# EAGLE design switch.m16 (EAGLE 6.5.0)
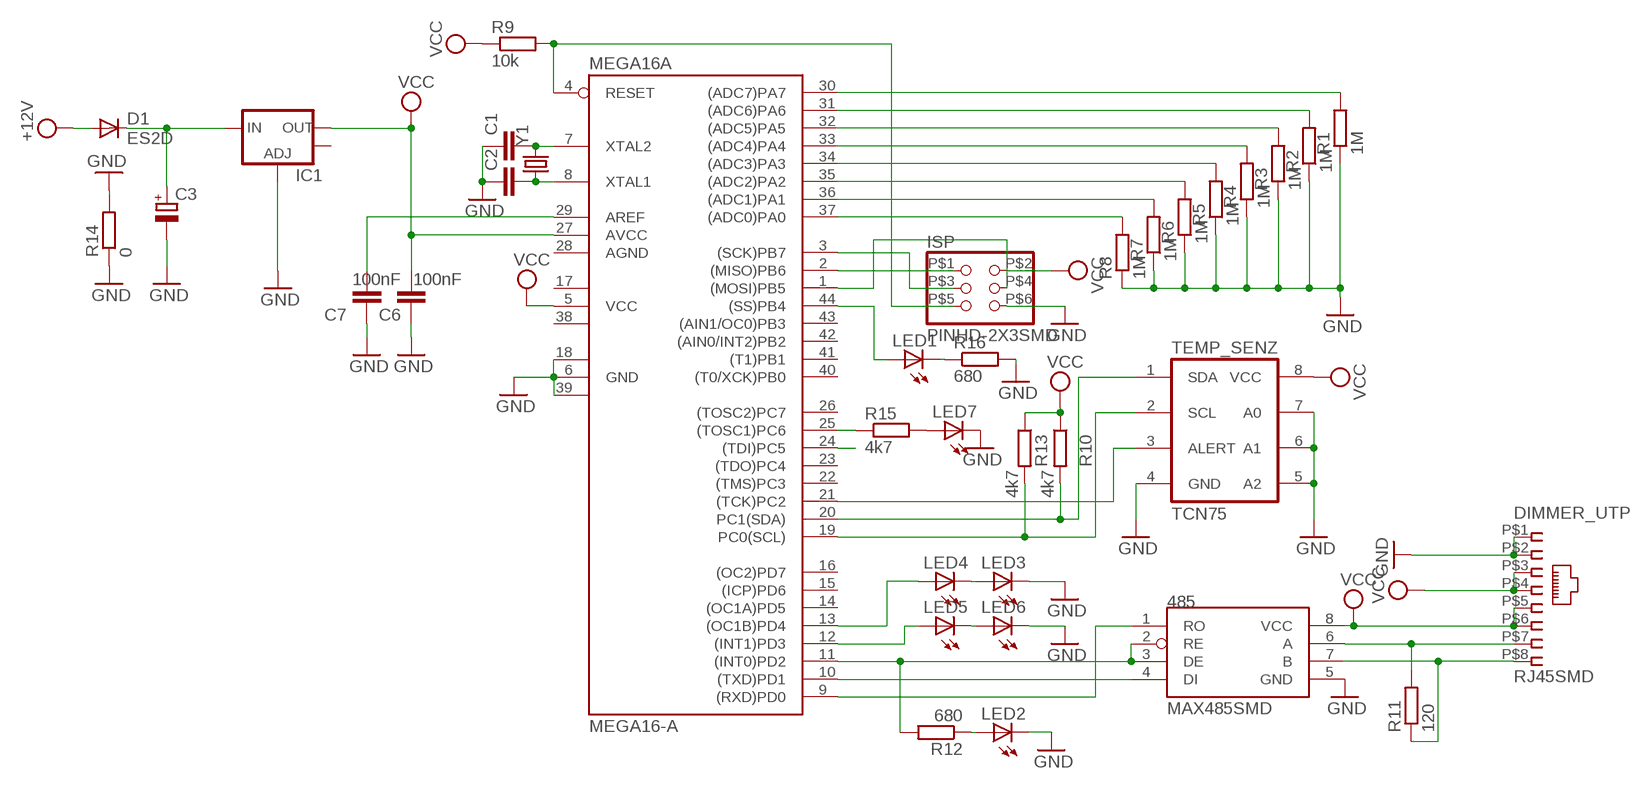
[diagram p0: schematic, sheet 1]

## Parts
485  MAX485SMD  [SO08]
C1  C-EUC0805  [C0805]
C2  C-EUC0805  [C0805]
C3  CPOL-EUSMCC  [SMC_C]
C6  100nF  C-EUC1206  [C1206]
C7  100nF  C-EUC1206  [C1206]
D1  ES2D  [SMB]
DIMMER_UTP  RJ45SMD  [RJ45SMD]
IC1  V_REG_LM1117SOT223  [SOT223]
ISP  PINHD-2X3SMD  [2X03SMD]
LED1  LEDSML1206  [SML1206]
LED2  LEDSML1206  [SML1206]
LED3  LEDSML1206  [SML1206]
LED4  LEDSML1206  [SML1206]
LED5  LEDSML1206  [SML1206]
LED6  LEDSML1206  [SML1206]
LED7  LEDSML1206  [SML1206]
MEGA16A  MEGA16-A  [TQFP44]
R1  1M  R-EU_R1206  [R1206]
R2  1M  R-EU_R1206  [R1206]
R3  1M  R-EU_R1206  [R1206]
R4  1M  R-EU_R1206  [R1206]
R5  1M  R-EU_R1206  [R1206]
R6  1M  R-EU_R1206  [R1206]
R7  1M  R-EU_R1206  [R1206]
R8  1M  R-EU_R1206  [R1206]
R9  10k  R-EU_R1206  [R1206]
R10  4k7  R-EU_R1206  [R1206]
R11  120  R-EU_R1206  [R1206]
R12  680  R-EU_R1206  [R1206]
R13  4k7  R-EU_R1206  [R1206]
R14  0  R-EU_R1206  [R1206]
R15  4k7  R-EU_R1206  [R1206]
R16  680  R-EU_R1206  [R1206]
TEMP_SENZ  TCN75  [SO08]
Y1  CRYSTAL5X3  [CRYSTAL-SMD-5X3]

## Nets
+12V: D1.A DIMMER_UTP.P$3 DIMMER_UTP.P$4 ; supply symbol labelled VCC
GND: 485.5(GND) C1.1 C2.1 C3.- C6.1 C7.2 DIMMER_UTP.P$1 DIMMER_UTP.P$2 IC1.1(ADJ) ISP.P$6 LED2.C LED3.C LED6.C LED7.C MEGA16A.6(GND) MEGA16A.18(GND1) MEGA16A.39(GND2) R1.1 R2.1 R3.1 R4.1 R5.1 R6.1 R7.1 R8.1 R14.1 R14.2 R16.2 TEMP_SENZ.4(GND) TEMP_SENZ.5(A2) TEMP_SENZ.6(A1) TEMP_SENZ.7(A0)
N$1: LED4.A MEGA16A.13((OC1B)PD4)
N$2: LED1.A MEGA16A.44((SS)PB4)
N$3: C3.+ D1.C IC1.3(IN)
N$4: MEGA16A.31((ADC6)PA6) R2.2
N$5: MEGA16A.30((ADC7)PA7) R1.2
N$6: MEGA16A.37((ADC0)PA0) R8.2
N$7: MEGA16A.34((ADC3)PA3) R5.2
N$8: MEGA16A.35((ADC2)PA2) R6.2
N$9: MEGA16A.25((TOSC1)PC6) R15.1
N$10: MEGA16A.19(PC0(SCL)) R13.2 TEMP_SENZ.2(SCL)
N$11: MEGA16A.20(PC1(SDA)) R10.2 TEMP_SENZ.1(SDA)
N$12: MEGA16A.21((TCK)PC2) TEMP_SENZ.3(ALERT)
N$13: LED7.A R15.2
N$15: 485.1(RO) MEGA16A.9((RXD)PD0)
N$16: 485.4(DI) MEGA16A.10((TXD)PD1)
N$17: 485.2(RE) 485.3(DE) MEGA16A.11((INT0)PD2) R12.2
N$18: LED5.A MEGA16A.12((INT1)PD3)
N$19: ISP.P$1 MEGA16A.2((MISO)PB6)
N$20: ISP.P$3 MEGA16A.3((SCK)PB7)
N$21: ISP.P$5 MEGA16A.4(RESET) R9.2
N$22: ISP.P$4 MEGA16A.1((MOSI)PB5)
N$23: 485.6(A) DIMMER_UTP.P$7 R11.2
N$24: 485.7(B) DIMMER_UTP.P$8 R11.1
N$28: C1.2 MEGA16A.7(XTAL2) Y1.3
N$29: C2.2 MEGA16A.8(XTAL1) Y1.1
N$30: LED2.A R12.1
N$31: MEGA16A.33((ADC4)PA4) R4.2
N$33: LED1.C R16.1
N$34: MEGA16A.32((ADC5)PA5) R3.2
N$35: MEGA16A.36((ADC1)PA1) R7.2
N$36: C7.1 MEGA16A.29(AREF)
N$37: LED3.A LED4.C
N$38: LED5.C LED6.A
PC5: MEGA16A.24((TDI)PC5)
VCC: 485.8(VCC) C6.2 DIMMER_UTP.P$5 DIMMER_UTP.P$6 IC1.2(OUT) ISP.P$2 MEGA16A.5(VCC) MEGA16A.27(AVCC) R9.1 R10.1 R13.1 TEMP_SENZ.8(VCC)
Unconnected: IC1.4(OUT) MEGA16A.14((OC1A)PD5) MEGA16A.15((ICP)PD6) MEGA16A.16((OC2)PD7) MEGA16A.22((TMS)PC3) MEGA16A.23((TDO)PC4) MEGA16A.26((TOSC2)PC7) MEGA16A.40((T0/XCK)PB0) MEGA16A.41((T1)PB1) MEGA16A.42((AIN0/INT2)PB2) MEGA16A.43((AIN1/OC0)PB3)

## Power pins joined to a net without a drawn wire
AGND: MEGA16A.28(AGND)
VCC1: MEGA16A.17(VCC1)
VCC2: MEGA16A.38(VCC2)

## Library data of the parts
485 = maxim:MAX485SMD
C1 C2 C6 C7 = rcl:C-EU: CAPACITOR, European symbol
C3 = rcl:CPOL-EU: POLARIZED CAPACITOR, European symbol
D1 = diode:ES2D: DIODE super fast rectifier, 2 A
DIMMER_UTP = con-tycoelectronics:RJ45SMD
IC1 = sparkfun:V_REG_LM1117: Voltage Regulator LM1117 Standard adjustable voltage regulator but in SMD form. Spark Fun Electronics SKU : COM-00595
ISP = pinhead:PINHD-2X3SMD
LED1-LED7 = led:LED: LED OSRAM: - CHIPLED LG R971, LG N971, LY N971, LG Q971, LY Q971, LO R971, LY R971 LH N974, LH R974 LS Q976, LO Q976, LY Q976 LO Q996 - Hyper CHIPLED LW Q18S LB Q993, LB Q99A, LB R99A - SideLED LS A670, LO A670, LY A670, LG A670, LP A670 LB A673, LV A673, LT A673, LW A673 LH A674 LY A675 LS A676, LA A676, LO A676, LY A676, LW A676 LS A679, LY A679, LG A679 - Hyper Micro SIDELED® LS Y876, LA Y876, LO Y876, LY Y876 LT Y87S - SmartLED LW L88C, LW L88S LB L89C, LB L89S, LG L890 LS L89K, LO L89K, LY L89K LS L896, LA L896, LO L896, LY L896 - TOPLED LS T670, LO T670, LY T670, LG T670, LP T670 LSG T670, LSP T670, LSY T670, LOP T670, LYG T670 LG T671, LOG T671, LSG T671 LB T673, LV T673, LT T673, LW T673 LH T674 LS T676, LA T676, LO T676, LY T676, LB T676, LH T676, LSB T676, LW T676 LB T67C, LV T67C, LT T67C, LS T67K, LO T67K, LY T67K, LW E67C LS E67B, LA E67B, LO E67B, LY E67B, LB E67C, LV E67C, LT E67C LW T67C LS T679, LY T679, LG T679 LS T770, LO T770, LY T770, LG T770, LP T770 LB T773, LV T773, LT T773, LW T773 LH T774 LS E675, LA E675, LY E675, LS T675 LS T776, LA T776, LO T776, LY T776, LB T776 LHGB T686 LT T68C, LB T68C - Hyper Mini TOPLED® LB M676 - Mini TOPLED Santana® LG M470 LS M47K, LO M47K, LY M47K Source: http://www.osram.convergy.de LUXEON: - LUMILED® LXK2-PW12-R00, LXK2-PW12-S00, LXK2-PW14-U00, LXK2-PW14-V00 LXK2-PM12-R00, LXK2-PM12-S00, LXK2-PM14-U00 LXK2-PE12-Q00, LXK2-PE12-R00, LXK2-PE12-S00, LXK2-PE14-T00, LXK2-PE14-U00 LXK2-PB12-K00, LXK2-PB12-L00, LXK2-PB12-M00, LXK2-PB14-N00, LXK2-PB14-P00, LXK2-PB14-Q00 LXK2-PR12-L00, LXK2-PR12-M00, LXK2-PR14-Q00, LXK2-PR14-R00 LXK2-PD12-Q00, LXK2-PD12-R00, LXK2-PD12-S00 LXK2-PH12-R00, LXK2-PH12-S00 LXK2-PL12-P00, LXK2-PL12-Q00, LXK2-PL12-R00 Source: www.luxeon.com KINGBRIGHT: KA-3528ASYC Source: www.kingbright.com
MEGA16A = avr-5:MEGA16: MICROCONTROLLER 16 Kbytes FLASH 1 kbytes SRAM 512 bytes EEPROM USART 8-channel 10 bit ADC
R1-R16 = rcl:R-EU_: RESISTOR, European symbol
TEMP_SENZ = linear:TCN75
Y1 = sparkfun:CRYSTAL: Crystals Various standard crystals. Proven footprints. Spark Fun Electronics SKU : COM-00534

## Net classes
0 default: width 0.406 mm, drill 0.406 mm, clearance 0.406 mm

## Board
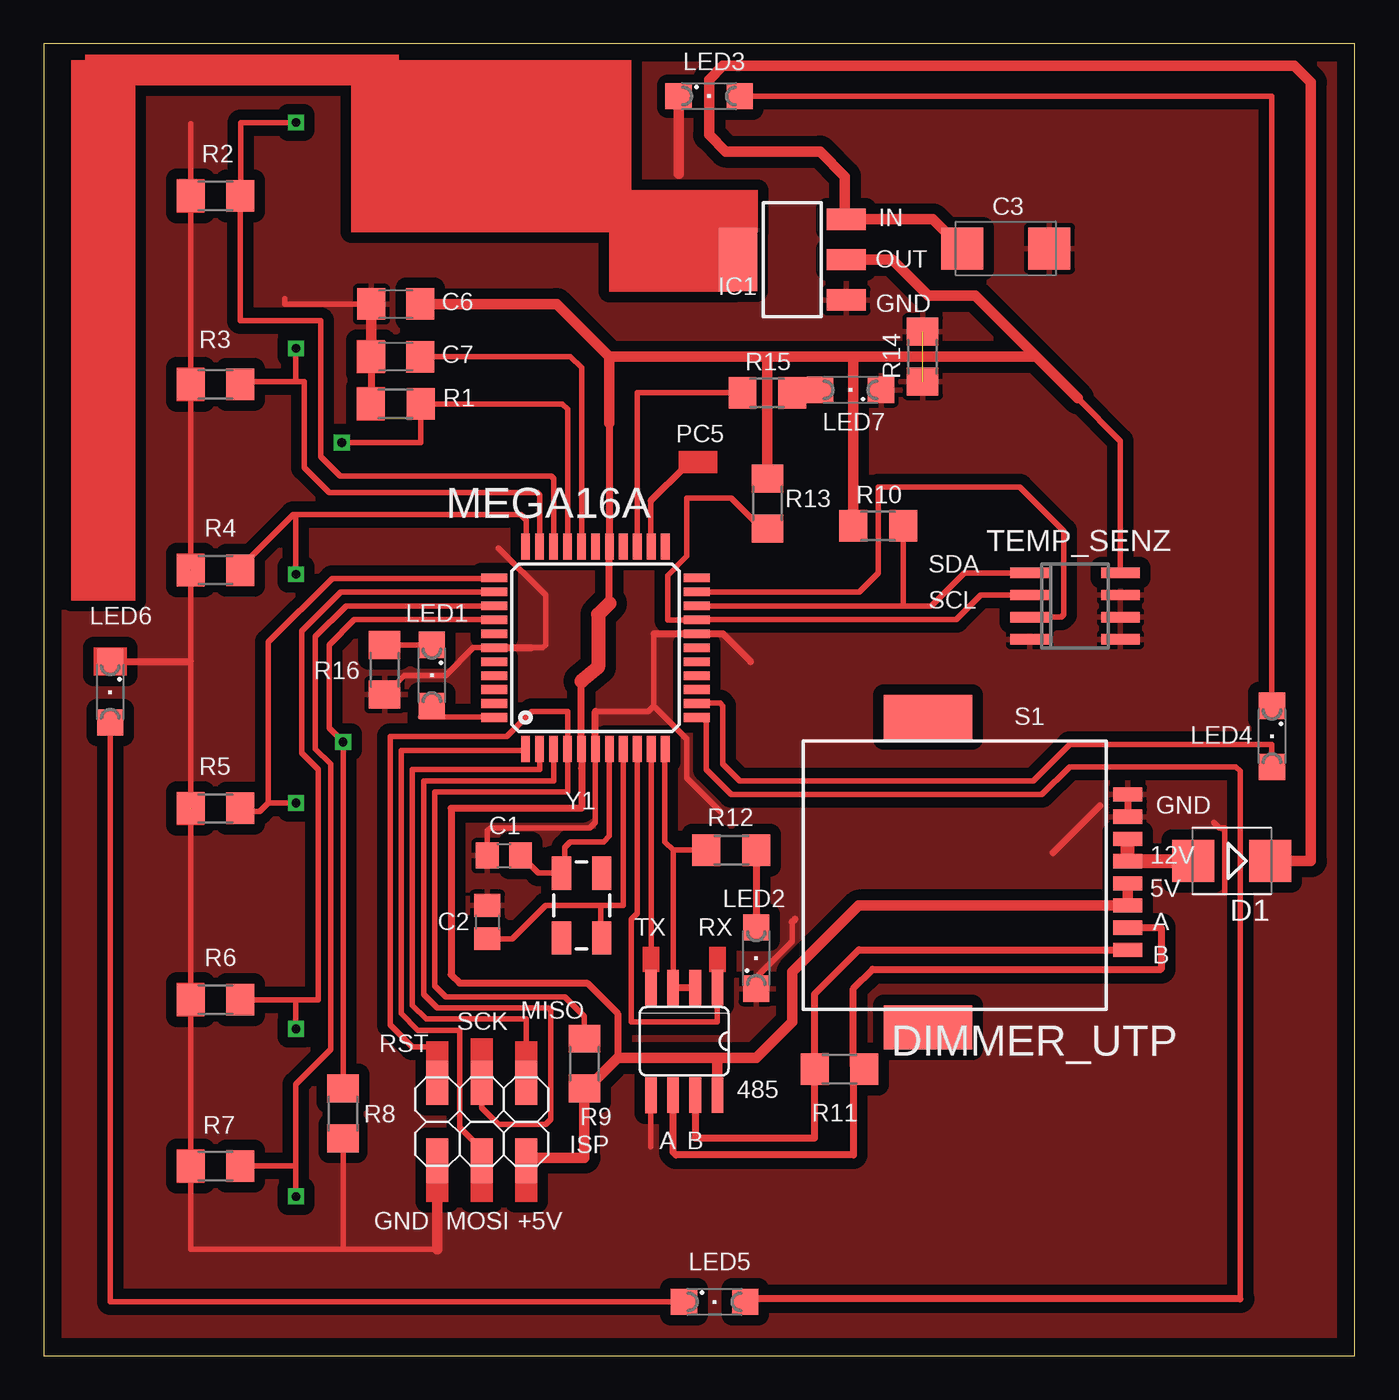
[diagram p1: board, top side]
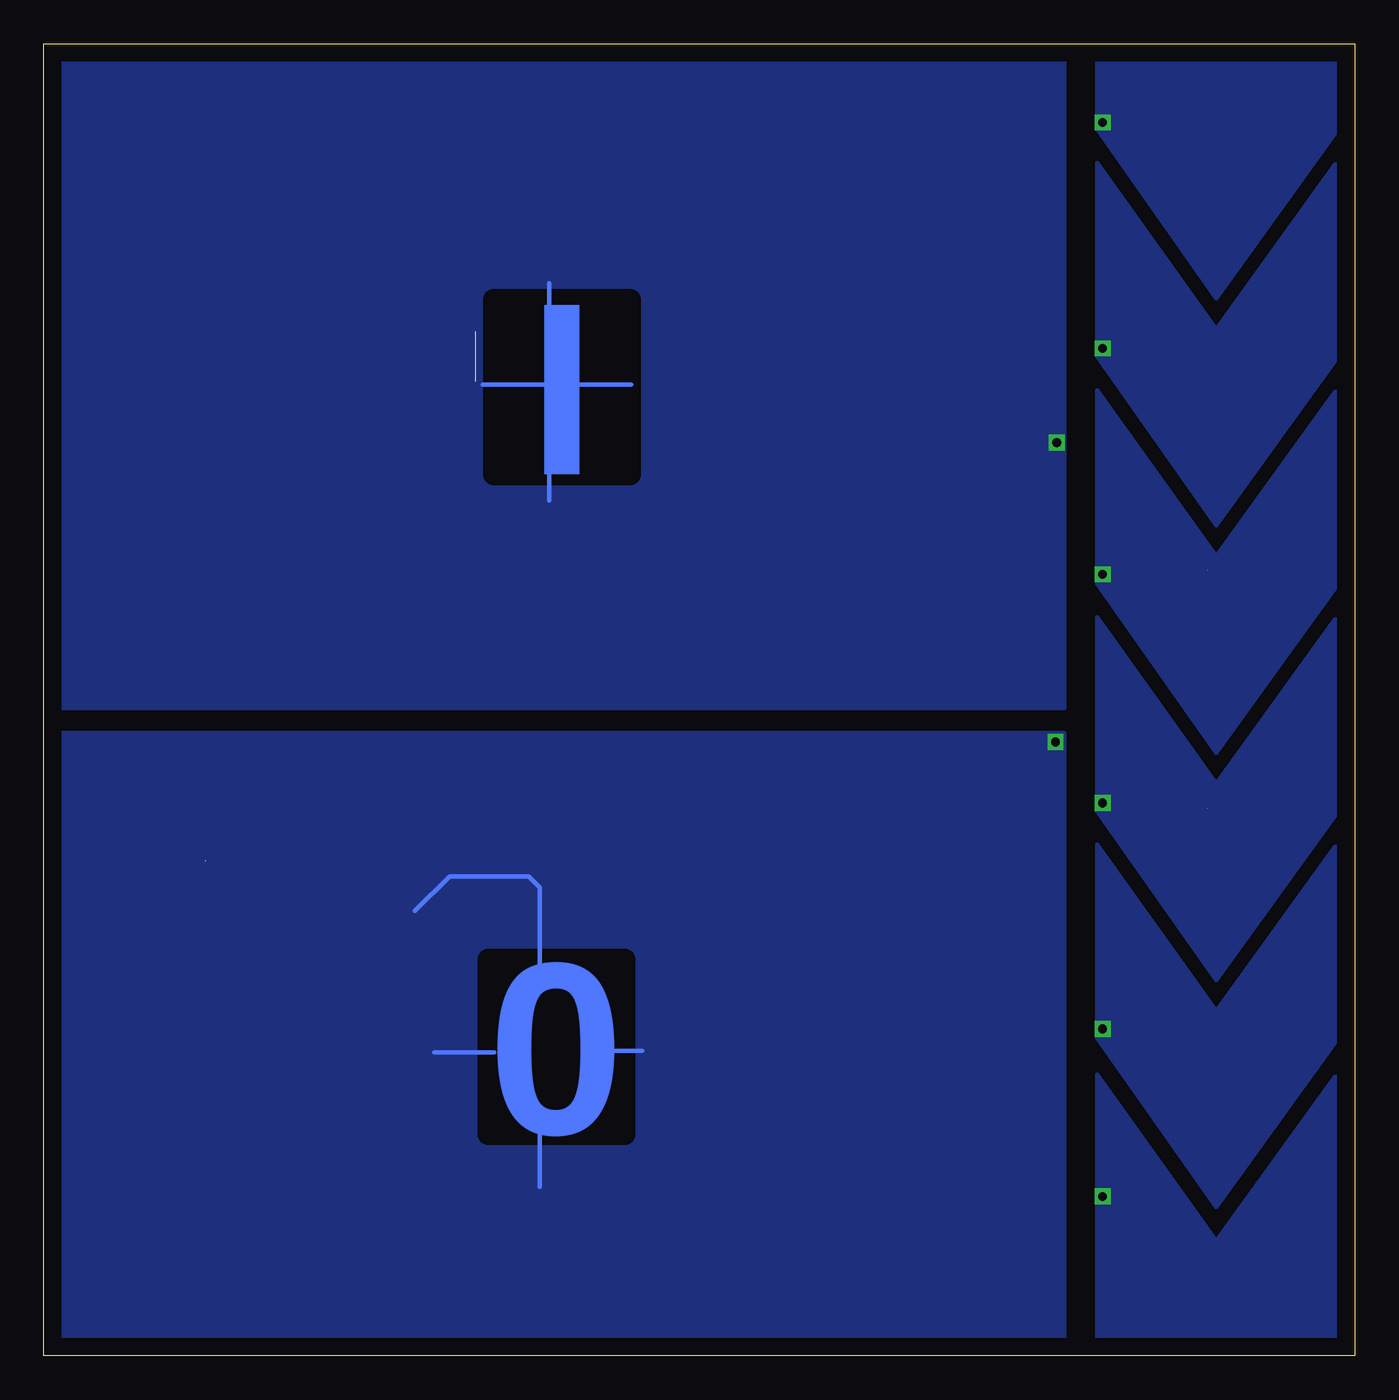
[diagram p2: board, bottom side, seen from below]

Size 75.08 x 75.16 mm. Coordinates in mm from the lower left corner, seen from the top.
Outline: 0,0 75.08,0 75.08,75.16 0,75.16 0,0
Copper layers (1*16): Top 0.035mm / dielectric 1.5mm / Bottom 0.035mm
Design rules "default": minimum track width 10mil, minimum drill 24mil, track to track 8mil, track to pad 8mil, pad to pad 8mil, via to via 8mil, smd to smd 8mil, copper to edge 40mil, drill to drill 8mil, minimum pad ring 10mil, minimum via ring 8mil, stop-mask expansion 4mil, vias tented up to drill 0mil, thermal gap 10mil

### Footprints (pad centres in the part's own frame; a part is rotated, then mirrored left to right if it is on the bottom)
SO08 = smd 0.66 x 2.032: 1 -1.905,-3.073; 2 -0.635,-3.073; 3 0.635,-3.073; 4 1.905,-3.073; 5 1.905,3.073; 6 0.635,3.073; 7 -0.635,3.073; 8 -1.905,3.073
C0805 = smd 1.3 x 1.5: 1 -0.95,0; 2 0.95,0
SMC_C = smd 2.4 x 2.4: + -2.5,0; - 2.5,0
C1206 = smd 1.6 x 1.8: 1 -1.4,0; 2 1.4,0
SMB = smd 2.4 x 2.4: A 2.2,0; C -2.2,0
RJ45SMD = smd 0.813 x 1.676: P$1 -4.445,8.255; P$2 -3.175,8.255; P$3 -1.905,8.255; P$4 -0.635,8.255; P$5 0.635,8.255; P$6 1.905,8.255; P$7 3.175,8.255; P$8 4.445,8.255 | smd 2.54 x 5.08: P$9 8.89,-3.175; P$10 -8.89,-3.175
SOT223 = smd 1.219 x 2.235: 1 -2.311,-3.099; 2 0,-3.099; 3 2.311,-3.099 | smd 3.6 x 2.2: 4 0,3.099
2X03SMD = smd 2.54 x 1.27: P$1 -0.953,5.08; P$2 3.493,5.08; P$3 -0.953,2.54; P$4 3.493,2.54; P$5 -0.953,0; P$6 3.493,0
SML1206 = smd 1.5 x 1.5: A 1.75,0; C -1.75,0
TQFP44 = smd 1.5 x 0.5: 1 -5.8,4; 2 -5.8,3.2; 3 -5.8,2.4; 4 -5.8,1.6; 5 -5.8,0.8; 6 -5.8,0; 7 -5.8,-0.8; 8 -5.8,-1.6; 9 -5.8,-2.4; 10 -5.8,-3.2; 11 -5.8,-4; 23 5.8,-4; 24 5.8,-3.2; 25 5.8,-2.4; 26 5.8,-1.6; 27 5.8,-0.8; 28 5.8,0; 29 5.8,0.8; 30 5.8,1.6; 31 5.8,2.4; 32 5.8,3.2; 33 5.8,4 | smd 0.5 x 1.5: 12 -4,-5.8; 13 -3.2,-5.8; 14 -2.4,-5.8; 15 -1.6,-5.8; 16 -0.8,-5.8; 17 0,-5.8; 18 0.8,-5.8; 19 1.6,-5.8; 20 2.4,-5.8; 21 3.2,-5.8; 22 4,-5.8; 34 4,5.8; 35 3.2,5.8; 36 2.4,5.8; 37 1.6,5.8; 38 0.8,5.8; 39 0,5.8; 40 -0.8,5.8; 41 -1.6,5.8; 42 -2.4,5.8; 43 -3.2,5.8; 44 -4,5.8
R1206 = smd 1.6 x 1.803: 1 -1.422,0; 2 1.422,0
SO08' = smd 0.6 x 2.2: 1 -1.905,-2.6; 2 -0.635,-2.6; 3 0.635,-2.6; 4 1.905,-2.6; 5 1.905,2.6; 6 0.635,2.6; 7 -0.635,2.6; 8 -1.905,2.6
CRYSTAL-SMD-5X3 = smd 1.9 x 1.1: 1 -1.85,-1.15; 2 1.85,-1.15; 3 1.85,1.15; 4 -1.85,1.15

### Placement (x,y rotation side)
485  36.67,18.02 180 top
C1  26.35,28.65 0 top
C2  25.4,24.84 270 top
C3  55.09,63.42 0 top
C6  20.16,60.25 0 top
C7  20.16,57.23 180 top
D1  68.02,28.34 180 top
DIMMER_UTP  53.82,27.7 270 top
IC1  42.86,62.79 90 top
ISP  22.54,14.68 270 top
LED1  22.23,38.97 270 top
LED2  40.8,22.78 90 top
LED3  38.1,72.15 0 top
LED4  70.33,35.48 270 top
LED5  38.42,3.1 0 top
LED6  3.81,38.02 270 top
LED7  46.2,55.32 180 top
MEGA16A  31.59,40.56 90 top
R1  20.16,54.53 0 top
R2  9.84,66.44 0 top
R3  9.84,55.64 0 top
R4  9.84,45.01 0 top
R5  9.84,31.35 0 top
R6  9.84,20.4 0 top
R7  9.84,10.87 0 top
R8  17.14,13.89 90 top
R9  30.96,16.75 90 top
R10  47.78,47.55 0 top
R11  45.56,16.43 0 top
R12  39.37,28.97 180 top
R13  41.43,48.82 270 top
R14  50.32,57.23 90 top
R15  41.43,55.17 0 top
R16  19.53,39.29 270 top
TEMP_SENZ  TCN75  [SO08']  59.05,42.94 270 top
Y1  30.8,25.8 90 top

### Tracks (layer width: path | path; a pad name or v marks a point on that pad's centre or on a via)
+12V  (1 unrouted)
  Top 0.813: DIMMER_UTP.P$3 DIMMER_UTP.P$4 65.81,28.34
GND  (3 unrouted)
  Top 0.305: 26.04,46.28 28.73,43.58 28.73,40.72 28.57,40.56 27.94,40.56 | 38.73,31.19 36.83,33.1 36.83,35.32 34.92,37.23 | R8.1 17.14,6.11 | MEGA16A.39 24.61,40.56 23.02,38.97 20.64,38.97 R16.2 | MEGA16A.6 31.59,30.56 31.27,30.24 25.56,30.24 25.4,30.09 C1.1 | 42.86,24.84 42.86,23.73 40.64,21.51 40.64,21.03 40.64,20.71 | 34.93,41.36 34.93,37.23 34.92,37.23 | 31.59,36.91 34.61,36.91 34.92,37.23 | R2.1 8.42,63.59 8.41,63.58 R3.1 R4.1 | 8.41,44.53 R5.1 | R6.1 R7.1 8.42,7.07 8.41,6.11 17.14,6.11 | 8.41,20.24 R5.1 | R2.1 8.41,70.56 | 22.54,6.11 17.14,6.11 | 485.5 34.77,11.99 | R1.1 18.73,60.25 13.81,60.25 13.81,60.56 | 67.63,26.51 67.63,30.24 67.31,30.24 66.99,30.56
  Top 0.406: R3.1 | LED6.C 8.42,39.77 | 8.41,11.19 R7.1 | C7.2 18.76,54.39 R1.1 | MEGA16A.39 27.94,40.56 | 8.41,44.53 R4.1 | R2.1 | MEGA16A.18 | 42.86,24.84 43.02,25 | 62.23,31.99 DIMMER_UTP.P$1 DIMMER_UTP.P$2 | 60.48,31.51 57.78,28.81 | MEGA16A.18 37.46,41.36 | 37.46,41.36 38.89,41.36 40.48,39.77 | 34.93,41.36 MEGA16A.18 | 37.46,41.36 37.47,41.35 | MEGA16A.6 31.59,36.91 | LED2.C 40.64,21.03
  Top 0.61: ISP.P$6 22.54,6.11 | C6.1 C7.2 | LED3.C 36.35,67.71
  pour Top (isolate 0.61): -0.56,75.09 75.72,75.09 75.8,-0.64 -0.64,-0.71
N$1
  Top 0.305: MEGA16A.13 37.42,37.39 38.73,37.39 38.89,37.23 38.89,33.89 39.85,32.94 56.67,32.94 58.74,35 70.32,35 LED4.A
N$2
  Top 0.305: MEGA16A.44 25.76,36.59 21.59,36.59 LED1.A
N$3
  Top 0.61: D1.C 72.55,28.34 72.55,72.95 71.6,73.9 38.89,73.9 38.1,73.1 38.1,69.93 39.05,68.98 44.45,68.98 45.88,67.55 45.88,65.18 IC1.3 50.91,65.1 C3.+
N$4
  Top 0.305: MEGA16A.31 29.21,46.38 29.21,50.24 29.05,50.4 16.99,50.4 15.88,51.51 15.88,59.29 11.26,59.29 R2.2
N$5  (via drill 0.5 pad 0.81)
  Top 0.305: 21.27,54.06 R1.2 | MEGA16A.30 30,46.37 30,54.21 29.69,54.52 R1.2 | v17.07,52.31 21.59,52.31 R1.2
  Bottom 0.254: 46.12,61.44 46.12,55.64 | 46.12,55.64 46.12,48.97 | 46.12,55.64 49.93,55.64 | 46.12,55.64 41.43,55.64
  pour Bottom (isolate 0.61): 16.67,75.33 16.67,37.15 75.88,37.15 75.88,75.33
N$6  (via drill 0.5 pad 0.81)
  Top 0.305: 25.78,42.15 MEGA16A.37 17.79,42.16 16.35,40.72 16.35,35.96 v17.14,35.16 R8.2
  Bottom 0.254: 43.74,17.46 40.8,17.46 | 46.67,13.57 46.67,9.68 | 49.29,17.38 52.7,17.38 | 46.67,21.51 46.67,26.83 47.31,27.46 51.83,27.46 53.82,25.48
  pour Bottom (isolate 0.61): 16.67,35.64 16.67,-0.08 75.88,-0.08 75.88,35.64
N$7  (via drill 0.5 pad 0.81)
  Top 0.305: 25.76,44.53 16.51,44.53 12.86,40.88 12.86,31.67 | R5.2 11.42,31.19 12.38,31.19 12.86,31.67 | v14.45,31.67 12.86,31.67
  Top 0.406: 25.76,44.53 MEGA16A.34
  pour Bottom: 14.76,42.31 7.94,32.78 0.95,42.47 0.95,31.19 7.94,21.51 14.76,31.19
N$8  (via drill 0.5 pad 0.81)
  Top 0.305: MEGA16A.35 17.01,43.76 14.76,41.51 14.76,34.53 15.72,33.58 15.72,20.4 14.45,20.4 | 14.45,20.4 v14.45,18.73 | R6.2 14.45,20.4
  Top 0.406: 25.77,43.74 MEGA16A.35
  pour Bottom: 14.76,29.29 7.94,19.76 0.95,29.45 0.95,18.18 7.94,8.49 14.76,18.18
N$9
  Top 0.305: R15.1 33.99,55.17 MEGA16A.25
N$10
  Top 0.305: TEMP_SENZ.2 53.66,43.58 52.24,42.16 MEGA16A.19 37.38,42.15 35.72,42.15 35.72,44.69 36.83,45.8 36.83,49.13 39.37,49.13 41.12,47.39 42.06,47.39 R13.2
  Top 0.406: R13.2 41.59,47.39
N$11
  Top 0.305: MEGA16A.20 49.21,42.96 | 49.21,42.96 50.82,42.96 52.7,44.85 TEMP_SENZ.1 | R10.2 49.21,42.97 49.21,42.96
N$12
  Top 0.305: MEGA16A.21 46.7,43.76 47.78,44.85 47.78,49.77 55.88,49.77 58.42,47.23 58.42,42.47 58.26,42.31 TEMP_SENZ.3
N$13
  Top 0.406: R15.2 44.45,55.17 LED7.A
N$15
  Top 0.305: MEGA16A.9 33.99,25.34 33.66,25 33.66,19.13 38.58,19.13 485.1
  Top 0.406: 38.58,21.19 485.1
N$16
  Top 0.305: MEGA16A.10 34.79,22.55
  Top 0.406: 34.79,22.55 485.4
N$17
  Top 0.305: 36.04,28.97 485.3 | R12.2 36.04,28.97 | 36.04,28.97 35.56,29.45 35.56,34.73 MEGA16A.11
  Top 0.406: 485.3 485.2
N$18
  Top 0.305: 68.5,3.25 68.5,33.5 68.26,33.73 58.74,33.73 57.15,32.15 39.37,32.15 37.94,33.58 37.94,36.27 37.81,36.56
  Top 0.406: MEGA16A.12 37.81,36.56 | 68.5,3.25 40.33,3.25 LED5.A
N$19
  Top 0.305: ISP.P$1 27.62,19.29 21.91,19.29 21.11,20.08 21.11,33.58 28.42,33.58 28.42,34.74 MEGA16A.2
N$20
  Top 0.305: MEGA16A.3 29.21,34.74 29.21,32.94 21.75,32.94 21.75,20.72 22.54,19.92 28.89,19.92 29.03,19.75 29.03,13.55 28.73,13.26 26.04,13.26 25.08,14.21 ISP.P$3
N$21
  Top 0.305: 22.54,17.86 22.54,17.7 | 22.54,17.7 ISP.P$5 | 22.54,17.7 21.11,17.7 19.84,18.97 19.84,35.48 26.51,35.48 27.94,36.91 30,36.91 30,34.77 MEGA16A.4 30,33.64 30,32.31 22.38,32.31 22.38,21.19 23.02,20.56 29.84,20.56 30.96,19.45 R9.2
  Top 0.406: MEGA16A.4 29.99,35.02
N$22
  Top 0.305: MEGA16A.1 27.36,34.69 20.48,34.69 20.48,19.61 21.43,18.65 23.81,18.65 23.81,13.1 25.08,11.83 ISP.P$4
  Top 0.406: 25.08,11.67 ISP.P$4
N$23
  Top 0.406: 46.35,16.58 R11.2 | 46.35,16.58 46.35,21.03 47.47,22.15 63.98,22.15 63.98,24.53 DIMMER_UTP.P$7 | 46.35,16.58 46.35,11.51 36.2,11.51 36.04,11.67 485.6
N$24
  Top 0.406: DIMMER_UTP.P$8 46.67,23.26 44.13,20.72 44.13,16.74 R11.1 44.13,16.27 44.13,12.46 37.31,12.46 485.7
N$28
  Top 0.305: C1.2 28.31,27.65 Y1.3 29.84,27.84 29.84,29.13 30.16,29.45 32.07,29.45 32.39,29.77 MEGA16A.7
N$29
  Top 0.305: MEGA16A.8 33.19,25.8 31.91,25.8 | Y1.1 31.75,23.19 31.75,24.69 31.91,24.84 31.91,25.8 | 31.91,25.8 28.73,25.8 26.83,23.89 C2.2
N$30
  Top 0.406: R12.1 LED2.A
N$31  (via drill 0.5 pad 0.81)
  Top 0.305: 27.59,46.47 MEGA16A.33 27.62,46.39 27.62,47.86 27.3,48.18 14.45,48.18 | R4.2 11.26,45.16 14.29,48.18 14.45,48.18 | v14.45,44.77 14.45,48.18
  pour Bottom: 14.76,55.32 7.94,45.8 0.95,55.48 0.95,44.21 7.94,34.53 14.76,44.21
N$33
  Top 0.305: R16.1 19.22,40.72 LED1.C
N$34  (via drill 0.5 pad 0.81)
  Top 0.305: 14.45,55.8 14.92,55.8 14.92,50.88 16.35,49.45 28.26,49.45 28.42,49.29 28.42,46.39 MEGA16A.32 | 14.45,55.8 11.42,55.8 | v14.45,57.71 14.45,55.8
  Top 0.406: 11.64,55.8 11.26,56.18 R3.2 11.42,55.8
  pour Bottom: 14.76,68.34 7.94,58.82 0.95,68.5 0.95,57.23 7.94,47.55 14.76,57.23
N$35  (via drill 0.5 pad 0.81)
  Top 0.305: 14.45,10.87 R7.2 | v14.45,9.13 14.45,10.87 | MEGA16A.36 17.32,42.96 15.56,41.2 15.56,34.77 16.43,33.89 16.43,17.54 14.45,15.56 14.45,10.87
  Top 0.406: 25.77,42.94 MEGA16A.36 | R7.2 11.43,11.03
  pour Bottom: 14.76,16.11 7.94,6.59 0.95,16.27 0.95,-0.08 14.76,-0.08
N$36
  Top 0.305: C7.1 30.16,57.23 30.8,56.59 MEGA16A.29
  Top 0.406: MEGA16A.29
N$37
  Top 0.305: LED3.A 70.33,72.15 LED4.C
N$38
  Top 0.305: LED6.A 3.81,3.1 LED5.C 34.61,3.1
N$44  (via drill 0.5 pad 0.81)
  Top 0.305: v14.45,70.64 11.27,70.64 11.27,66.28
  pour Bottom: 14.76,75.33 0.95,75.33 0.95,70.25 7.94,60.56 14.76,70.25
PC5
  Top 0.305: MEGA16A.24 34.77,46.36 34.77,48.97
  Top 0.406: 36.67,50.88 34.77,48.97
VCC
  Top 0.305: 59.21,54.85 61.66,52.41 TEMP_SENZ.8
  Top 0.406: 30.79,38.65 MEGA16A.5 30.8,33.64 30.8,31.35 23.34,31.35 23.34,21.83 23.81,21.35 31.11,21.35 32.86,19.61 32.86,17.07 32.86,16.91 | 32.38,53.43 MEGA16A.27 32.38,43.1
  Top 0.61: 32.38,57.23 32.38,53.43 | DIMMER_UTP.P$5 DIMMER_UTP.P$6 46.67,25.8 42.86,21.99 42.86,19.13 40.8,17.07 38.58,17.07 | 27.78,11.35 30.96,11.35 R9.1 31.12,15.33 32.86,17.07 38.58,17.07 | 485.8 38.58,17.07 | 32.38,57.23 41.43,57.23 | 41.43,57.23 46.35,57.23 | 46.35,57.23 56.83,57.23 | 56.83,57.23 59.21,54.85 | R13.1 41.43,57.23 | R10.1 46.36,55.16 46.35,57.23 | IC1.2 48.58,62.79 50.64,60.72 53.34,60.72 56.83,57.23 | C6.2 29.37,60.25 32.38,57.23
  Top 0.813: 30.79,38.65 31.75,39.45 31.75,42.47 32.38,43.1 | 27.78,11.35 ISP.P$2
(copper drawn outside any net)
  shapes: Top area x29

### Text on the board
Bottom: I | 0
tNames: IN | OUT | GND | PC5 | SDA | SCL | S1 | GND | 12V | 5V | TX | RX | A | B | SCK | MISO | RST | A | B | GND | MOSI | +5V
bStop: I | 0